# Altium schematic sheet car_in.SchDoc
size A4
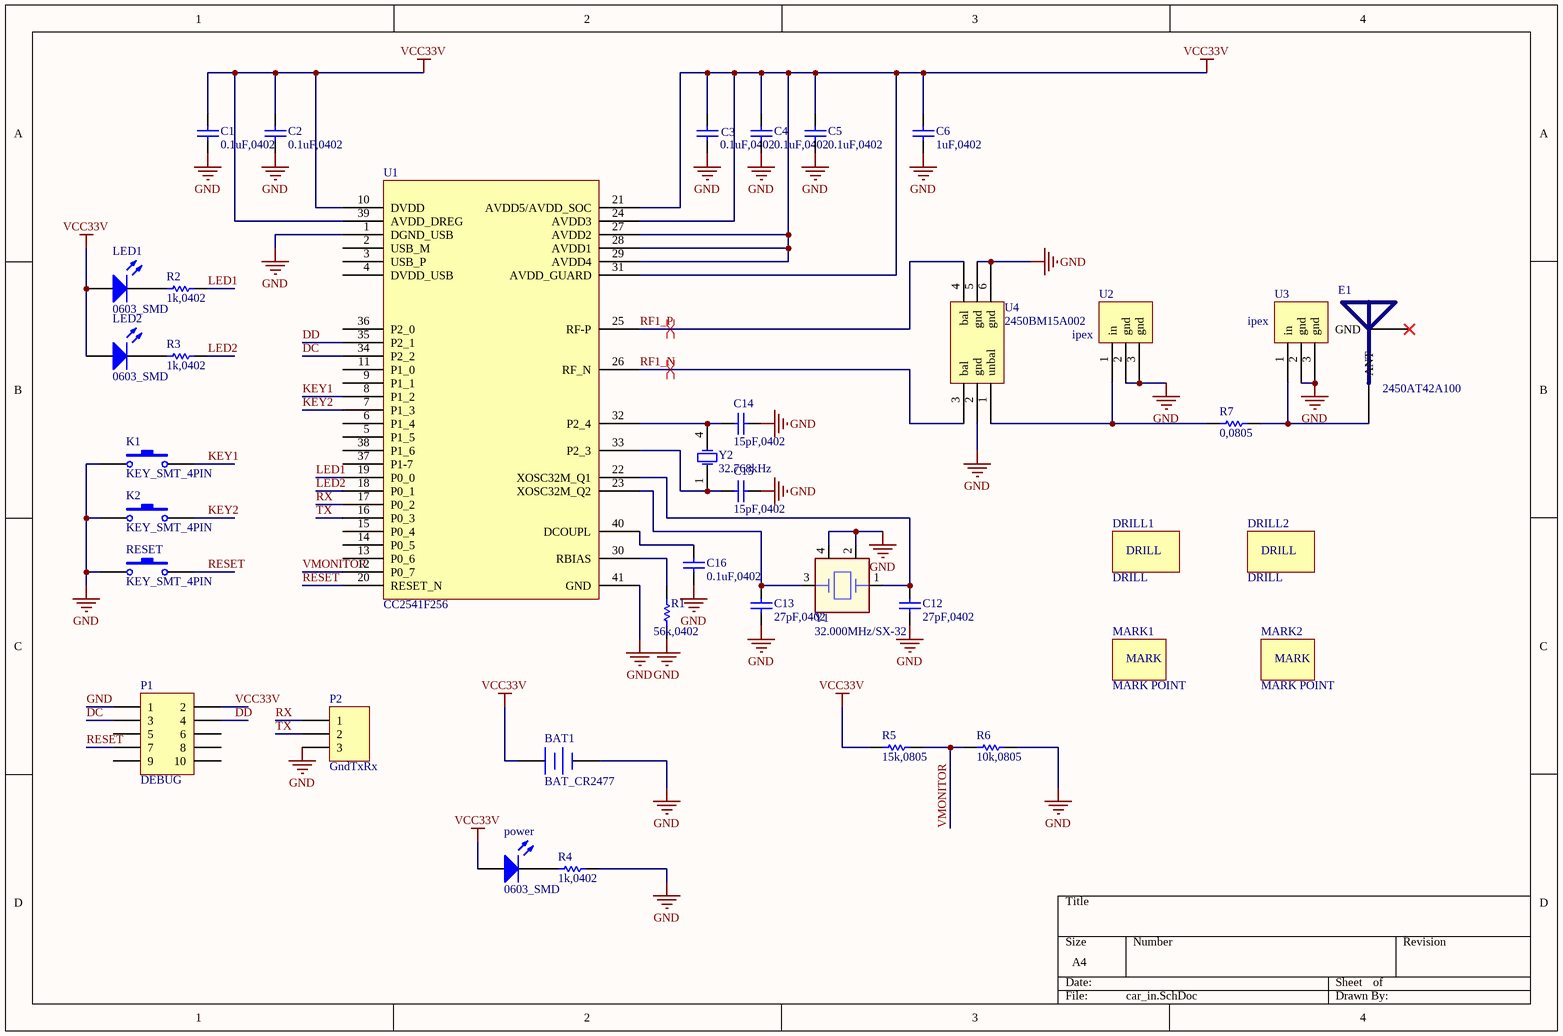
[diagram p0: car_in.SchDoc]

## Parts
BAT1  BAT_CR2477  [CR2477]
C1  0.1uF,0402  [C0402]
C2  0.1uF,0402  [C0402]
C3  0.1uF,0402  [C0402]
C4  0.1uF,0402  [C0402]
C5  0.1uF,0402  [C0402]
C6  1uF,0402  [C0402]
C12  27pF,0402  [C0402]
C13  27pF,0402  [C0402]
C14  15pF,0402  [C0402]
C15  15pF,0402  [C0402]
C16  0.1uF,0402  [C0402]
DRILL1  DRILL  [DRILL_2MM]
DRILL2  DRILL  [DRILL_2MM]
E1  2450AT42A100  [BT_ANT_PCB]
K1  KEY_SMT_4PIN  [KEY-SMT]
K2  KEY_SMT_4PIN  [KEY-SMT]
LED1  0603_SMD  [LED0603]
LED2  0603_SMD  [LED0603]
MARK1  MARK POINT  [MARK_POINT]
MARK2  MARK POINT  [MARK_POINT]
P1  DEBUG  [HDR2X5]
P2  GndTxRx  [HDR1X3]
power  0603_SMD  [LED0603]
R1  56k,0402  [R0402]
R2  1k,0402  [R0402]
R3  1k,0402  [R0402]
R4  1k,0402  [R0402]
R5  15k,0805  [R0805]
R6  10k,0805  [R0805]
R7  0,0805  [R0805]
RESET  KEY_SMT_4PIN  [KEY-SMT]
U1  CC2541F256  [PQFP40]
U2  ipex  [IPEX]
U3  ipex  [IPEX]
U4  2450BM15A002  [2450BM15A002]
Y1  32.000MHz/SX-32  [1210]
Y2  32.768kHz  [1206]

## Nets
GND: BAT1.2(-) C1.1 C2.1 C3.2 C4.1 C5.1 C6.1 C12.1 C13.1 C14.2 C15.2 C16.1 K1.1 K2.1 P1.1 P2.3 R1.1 R4.2 R6.2 RESET.1 U1.1(DGND_USB) U1.41(GND) U2.2(gnd) U2.3(gnd) U3.2(gnd) U3.3(gnd) U4.2(gnd) U4.5(gnd) U4.6(gnd) Y1.2 Y1.4
VCC33V: BAT1.1(+) C1.2 C2.2 C3.1 C4.2 C5.2 C6.2 LED1.1(A) LED2.1(A) P1.2 power.1(A) R5.1 U1.10(DVDD) U1.21(AVDD5/AVDD_SOC) U1.24(AVDD3) U1.27(AVDD2) U1.28(AVDD1) U1.29(AVDD4) U1.31(AVDD_GUARD) U1.39(AVDD_DREG)
DC: P1.3 U1.34(P2_2)
DD: P1.4 U1.35(P2_1)
KEY1: K1.2 U1.8(P1_2)
KEY2: K2.2 U1.7(P1_3)
LED1: R2.2 U1.19(P0_0)
LED2: R3.2 U1.18(P0_1)
RESET: P1.7 RESET.2 U1.20(RESET_N)
RF1_N: U1.26(RF_N) U4.3(bal)
RF1_P: U1.25(RF-P) U4.4(bal)
RX: P2.1 U1.17(P0_2)
TX: P2.2 U1.16(P0_3)
VMONITOR: R5.2 R6.1 U1.12(P0_7)
NetC12_2: C12.2 U1.22(XOSC32M_Q1) Y1.1
NetC13_2: C13.2 U1.23(XOSC32M_Q2) Y1.3
NetC14_1: C14.1 U1.32(P2_4) Y2.4(OSC2)
NetC15_1: C15.1 U1.33(P2_3) Y2.1(OSC1)
NetC16_2: C16.2 U1.40(DCOUPL)
NetE1_1: E1.1(ANT) R7.2 U3.1(in)
NetLED1_2: LED1.2(K) R2.1
NetLED2_2: LED2.2(K) R3.1
Netpower_2: power.2(K) R4.1
NetR1_2: R1.2 U1.30(RBIAS)
NetR7_1: R7.1 U2.1(in) U4.1(unbal)

Not connected (* = marked no-connect by the designer): E1 2(GND)*; P1 5 6 8 9 10; U1 2(USB_M) 3(USB_P) 4(DVDD_USB) 5(P1_5) 6(P1_4) 9(P1_1) 11(P1_0) 13(P0_6) 14(P0_5) 15(P0_4) 36(P2_0) 37(P1-7) 38(P1_6)

## Layout directives
differential pair: RF1_N, RF1_P

## Notes on the sheet
- (in symbol MARK_POINT) MARK

## Library data of the parts
BAT1 = BAT: battery; value: CR2447
C1-C6 C12-C16 = CAP: Capacitor; Published: 8-Jun-2000; Revision: July-2002: Re-released for DXP Platform.; Publisher: Altium Limited
  C1-C5 C16: Value: 0.1uF
  C6: Value: 1uF
  C12 C13: Value: 27pF
  C14 C15: Value: 15pF
E1 = BT_ANT_PCB
K1 K2 RESET = KEY
LED1 LED2 power = LED
MARK1 MARK2 = MARK_POINT
P1 = Header 5X2: Header, 5-Pin, Dual row; LatestRevisionDate: 17-Jul-2002; LatestRevisionNote: Re-released for DXP Platform.; Publisher: Altium Limited
P2 = Header 3: Header, 3-Pin; LatestRevisionDate: 17-Jul-2002; LatestRevisionNote: Re-released for DXP Platform.; Publisher: Altium Limited
R1-R6 = Res1: Resistor; Published: 8-Jun-2000; Revision: July-2002: Re-released for DXP Platform.; Publisher: Altium Limited
  R1: value: 56k
  R2-R4: value: 1k
  R5: value: 15k
  R6: value: 10k
R7 = Res1: Resistor; value: 10k; Published: 8-Jun-2000; Revision: July-2002: Re-released for DXP Platform.; Publisher: Altium Limited
U1 = CC254x: TI cc2541F256; value: cc2541F256
Y1 = CRYSTAL_5: SPXO; value: 32MHz
Y2 = DA740C: crystal; pin to pad: 4>2; value: 32.768kHz